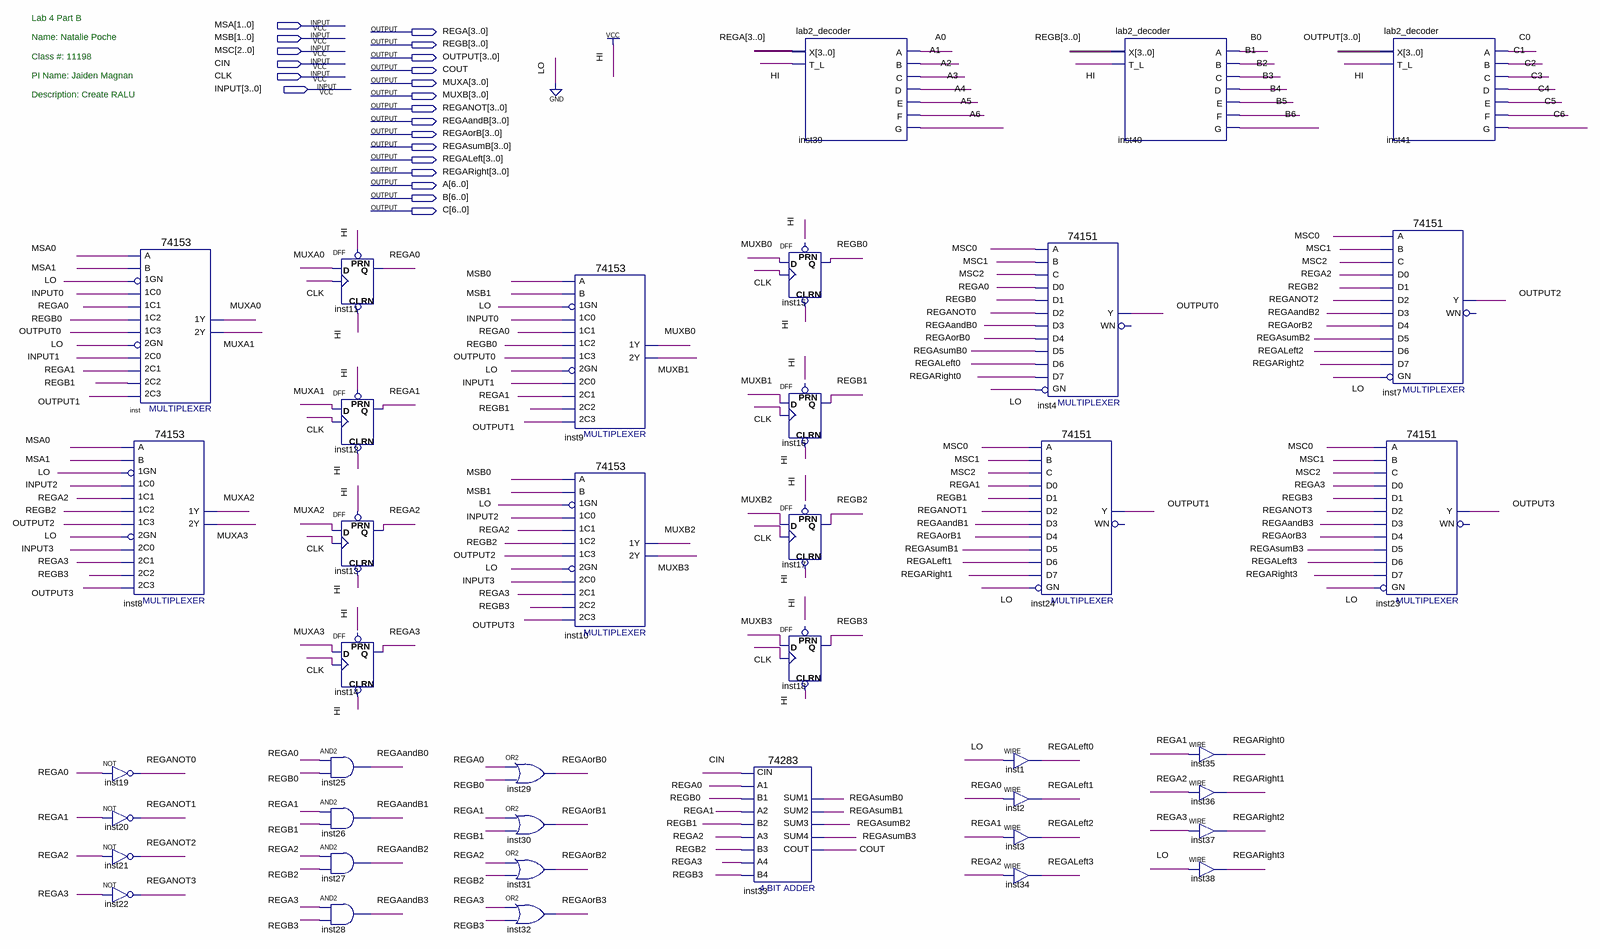
[diagram p0: schematic sheet]
// Quartus schematic Lab4_RALU.bdf as structural Verilog: 40 symbols, 21 pins
module Lab4_RALU (
  input  [1:0] MSA,
  input  [1:0] MSB,
  input  [2:0] MSC,
  input  CIN,
  input  CLK,
  input  [3:0] INPUT,
  output [3:0] REGA,
  output [3:0] REGB,
  output [3:0] OUTPUT,
  output COUT,
  output [3:0] MUXA,
  output [3:0] MUXB,
  output [3:0] REGANOT,
  output [3:0] REGAandB,
  output [3:0] REGAorB,
  output [3:0] REGAsumB,
  output [3:0] REGALeft,
  output [3:0] REGARight,
  output [6:0] A,
  output [6:0] B,
  output [6:0] C
);

  not inst19 (REGANOT[0], REGA[0]);
  not inst20 (REGANOT[1], REGA[1]);
  not inst21 (REGANOT[2], REGA[2]);
  not inst22 (REGANOT[3], REGA[3]);
  \74153  inst (
    .\1C1 (REGA[0]), .\1GN (1'b0), .\1C0 (INPUT[0]), .\2C0 (INPUT[1]), .\2GN (1'b0), .\2C2 (REGB[1]),
    .\1C2 (REGB[0]), .\1C3 (OUTPUT[0]), .B(MSA[1]), .A(MSA[0]), .\2C1 (REGA[1]), .\2C3 (OUTPUT[1]),
    .\1Y (MUXA[0]), .\2Y (MUXA[1]));
  \74153  inst8 (
    .\1C1 (REGA[2]), .\1GN (1'b0), .\1C0 (INPUT[2]), .\2C0 (INPUT[3]), .\2GN (1'b0), .\2C2 (REGB[3]),
    .\1C2 (REGB[2]), .\1C3 (OUTPUT[2]), .B(MSA[1]), .A(MSA[0]), .\2C1 (REGA[3]), .\2C3 (OUTPUT[3]),
    .\1Y (MUXA[2]), .\2Y (MUXA[3]));
  DFF inst11 (.CLRN(1'b1), .CLK(CLK), .D(MUXA[0]), .PRN(1'b1), .Q(REGA[0]));
  DFF inst12 (.CLRN(1'b1), .CLK(CLK), .D(MUXA[1]), .PRN(1'b1), .Q(REGA[1]));
  DFF inst13 (.CLRN(1'b1), .CLK(CLK), .D(MUXA[2]), .PRN(1'b1), .Q(REGA[2]));
  DFF inst14 (.CLRN(1'b1), .CLK(CLK), .D(MUXA[3]), .Q(REGA[3]));  // open: PRN
  and inst25 (REGAandB[0], REGA[0], REGB[0]);
  and inst26 (REGAandB[1], REGA[1], REGB[1]);
  and inst27 (REGAandB[2], REGA[2], REGB[2]);
  and inst28 (REGAandB[3], REGA[3], REGB[3]);
  or inst29 (REGAorB[0], REGA[0], REGB[0]);
  or inst30 (REGAorB[1], REGA[1], REGB[1]);
  or inst31 (REGAorB[2], REGA[2], REGB[2]);
  or inst32 (REGAorB[3], REGA[3], REGB[3]);
  \74153  inst9 (
    .\1C1 (REGA[0]), .\1GN (1'b0), .\1C0 (INPUT[0]), .\2C0 (INPUT[1]), .\2GN (1'b0), .\2C2 (REGB[1]),
    .\1C2 (REGB[0]), .\1C3 (OUTPUT[0]), .B(MSB[1]), .A(MSB[0]), .\2C1 (REGA[1]), .\2C3 (OUTPUT[1]),
    .\1Y (MUXB[0]), .\2Y (MUXB[1]));
  \74153  inst10 (
    .\1C1 (REGA[2]), .\1GN (1'b0), .\1C0 (INPUT[2]), .\2C0 (INPUT[3]), .\2GN (1'b0), .\2C2 (REGB[3]),
    .\1C2 (REGB[2]), .\1C3 (OUTPUT[2]), .B(MSB[1]), .A(MSB[0]), .\2C1 (REGA[3]), .\2C3 (OUTPUT[3]),
    .\1Y (MUXB[2]), .\2Y (MUXB[3]));
  \74283  inst33 (
    .CIN(CIN), .A1(REGA[0]), .A2(REGA[1]), .B2(REGB[1]), .A3(REGA[2]), .A4(REGA[3]), .B4(REGB[3]),
    .B1(REGB[0]), .B3(REGB[2]), .SUM4(REGAsumB[3]), .COUT(COUT), .SUM1(REGAsumB[0]), .SUM2(REGAsumB[1]),
    .SUM3(REGAsumB[2]));
  lab2_decoder inst39 (.X(REGA), .T_L(1'b1), .A(A[0]), .B(A[1]), .C(A[2]), .D(A[3]), .E(A[4]), .F(A[5]), .G(A[6]));
  DFF inst15 (.CLRN(1'b1), .CLK(CLK), .D(MUXB[0]), .Q(REGB[0]));  // open: PRN
  DFF inst16 (.CLRN(1'b1), .CLK(CLK), .D(MUXB[1]), .Q(REGB[1]));  // open: PRN
  DFF inst17 (.CLRN(1'b1), .CLK(CLK), .D(MUXB[2]), .Q(REGB[2]));  // open: PRN
  DFF inst18 (.CLRN(1'b1), .CLK(CLK), .D(MUXB[3]), .Q(REGB[3]));  // open: PRN
  \74151  inst24 (
    .GN(1'b0), .C(MSC[2]), .B(MSC[1]), .A(MSC[0]), .D5(REGAsumB[1]), .D0(REGA[1]), .D1(REGB[1]),
    .D4(REGAorB[1]), .D3(REGAandB[1]), .D2(REGANOT[1]), .D6(REGALeft[1]), .D7(REGARight[1]), .Y(OUTPUT[1]));  // open: WN
  assign REGALeft[0] = 1'b0;  // WIRE inst1
  assign REGALeft[1] = REGA[0];  // WIRE inst2
  assign REGALeft[2] = REGA[1];  // WIRE inst3
  assign REGALeft[3] = REGA[2];  // WIRE inst34
  \74151  inst4 (
    .GN(1'b0), .C(MSC[2]), .B(MSC[1]), .A(MSC[0]), .D5(REGAsumB[0]), .D0(REGA[0]), .D1(REGB[0]),
    .D4(REGAorB[0]), .D3(REGAandB[0]), .D2(REGANOT[0]), .D6(REGALeft[0]), .D7(REGARight[0]), .Y(OUTPUT[0]));  // open: WN
  lab2_decoder inst40 (.X(REGB), .T_L(1'b1), .A(B[0]), .B(B[1]), .C(B[2]), .D(B[3]), .E(B[4]), .F(B[5]), .G(B[6]));
  assign REGARight[0] = REGA[1];  // WIRE inst35
  assign REGARight[1] = REGA[2];  // WIRE inst36
  assign REGARight[2] = REGA[3];  // WIRE inst37
  assign REGARight[3] = 1'b0;  // WIRE inst38
  lab2_decoder inst41 (.X(OUTPUT), .T_L(1'b1), .A(C[0]), .B(C[1]), .C(C[2]), .D(C[3]), .E(C[4]), .F(C[5]), .G(C[6]));
  \74151  inst7 (
    .GN(1'b0), .C(MSC[2]), .B(MSC[1]), .A(MSC[0]), .D5(REGAsumB[2]), .D0(REGA[2]), .D1(REGB[2]),
    .D4(REGAorB[2]), .D3(REGAandB[2]), .D2(REGANOT[2]), .D6(REGALeft[2]), .D7(REGARight[2]), .Y(OUTPUT[2]));  // open: WN
  \74151  inst23 (
    .GN(1'b0), .C(MSC[2]), .B(MSC[1]), .A(MSC[0]), .D5(REGAsumB[3]), .D0(REGA[3]), .D1(REGB[3]),
    .D4(REGAorB[3]), .D3(REGAandB[3]), .D2(REGANOT[3]), .D6(REGALeft[3]), .D7(REGARight[3]), .Y(OUTPUT[3]));  // open: WN

  // Notes on the sheet:
  //   Lab 4 Part B
  //   Name: Natalie Poche
  //   Class #: 11198
  //   PI Name: Jaiden Magnan
  //   Description: Create RALU
endmodule
